# EAGLE schematic UV_Curing-PCB (EAGLE 9.6.2)
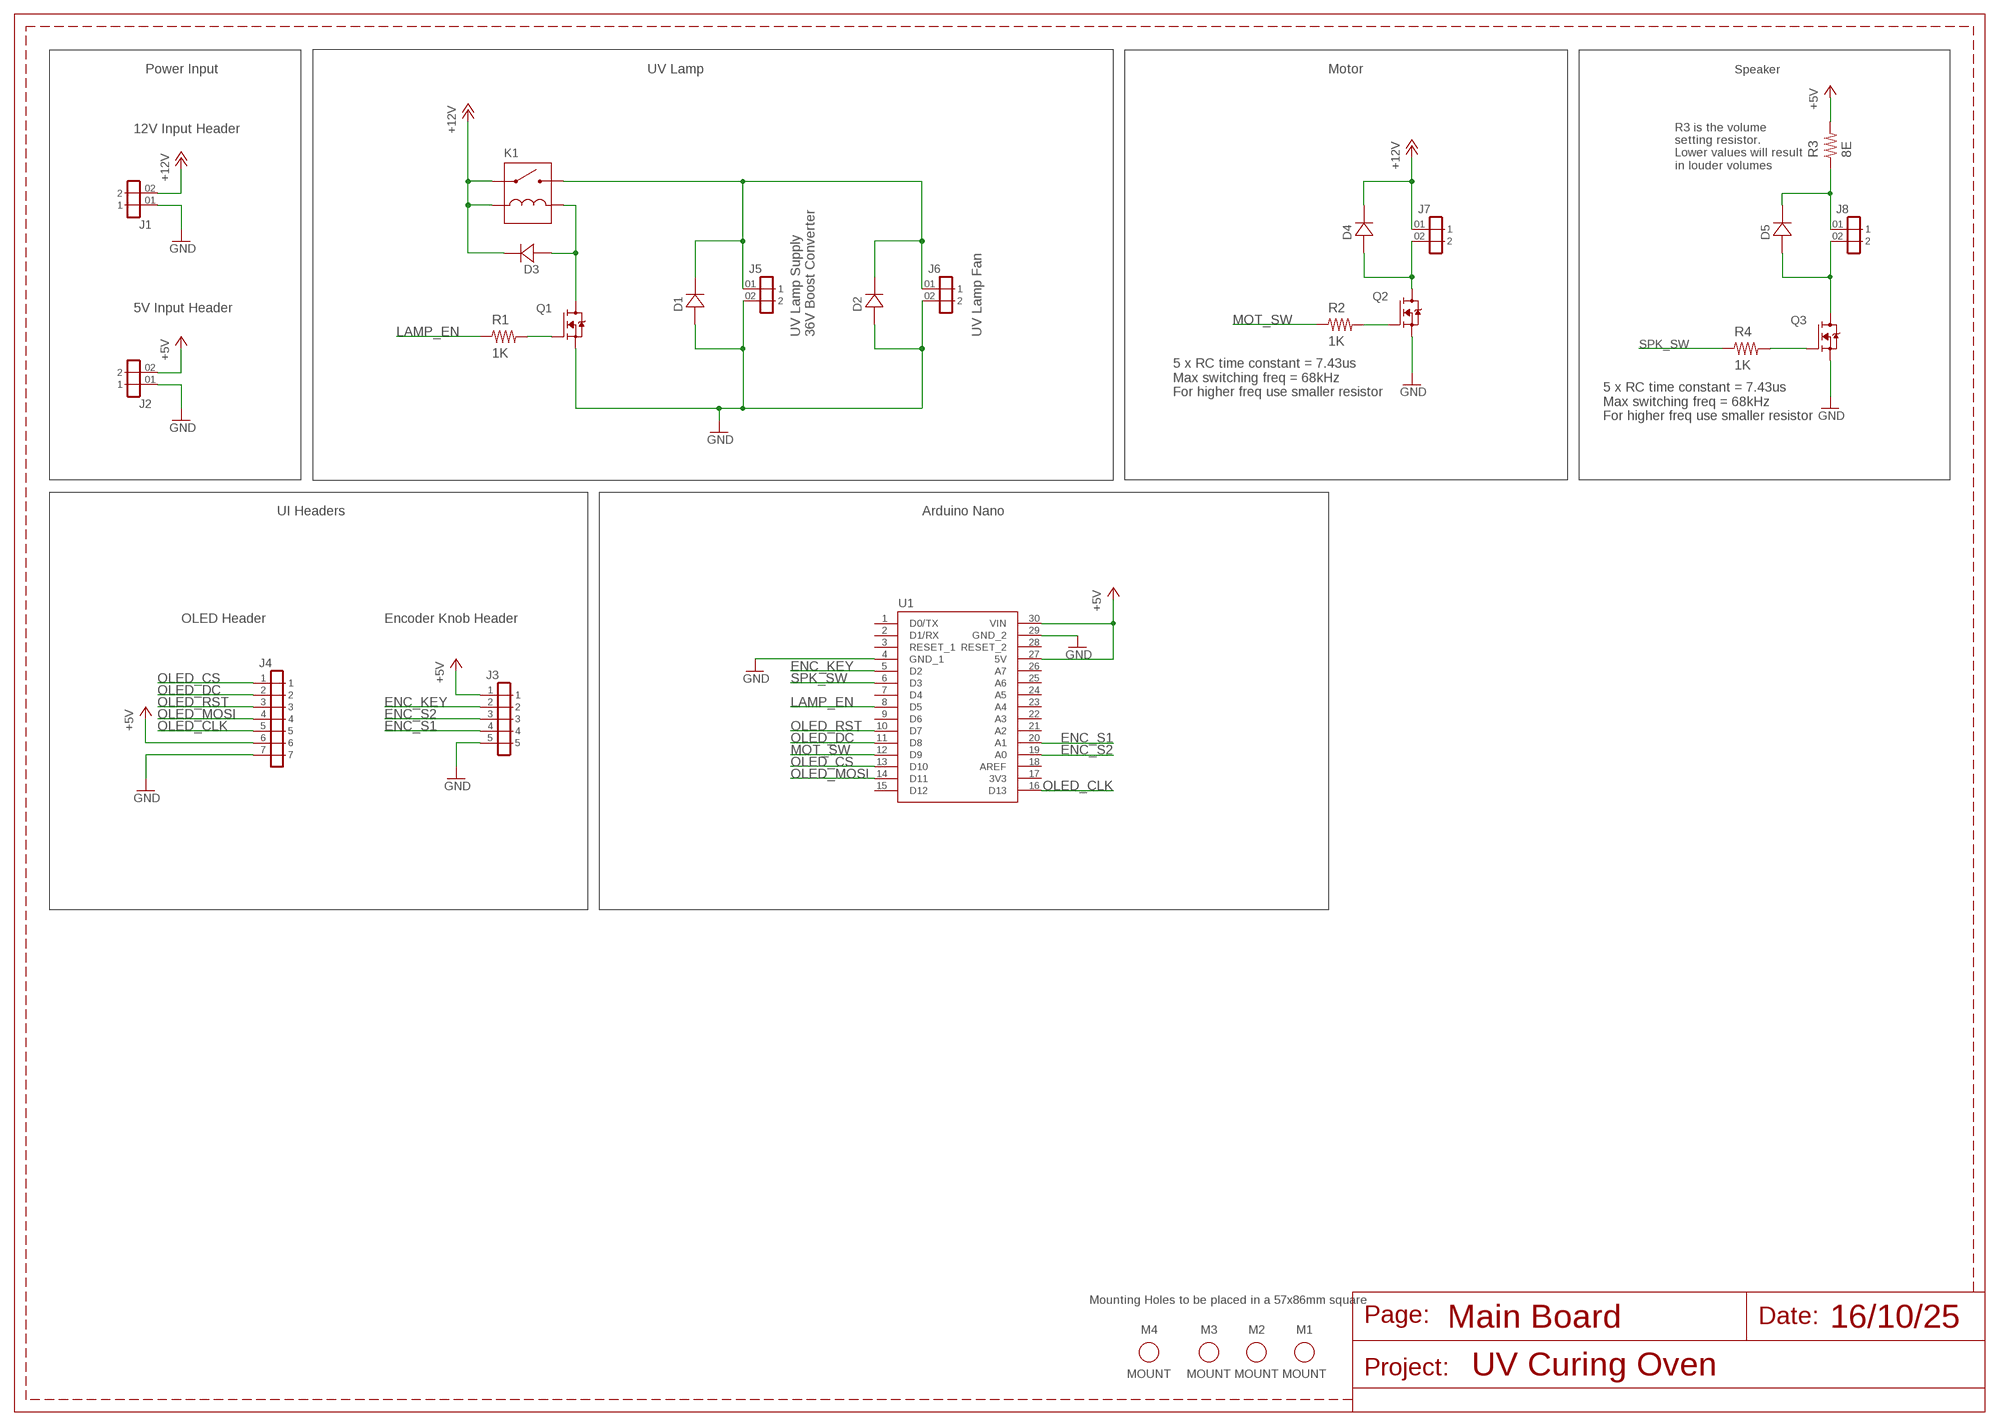
[diagram p0: schematic, sheet 1]
PF1 (A3_FRAME): DATE: 16/10/25; PAGE: Main Board; PROJECT: UV Curing Oven

## Parts
D1  400V  DIODE-DO-41-TH  [DIOAD520W79L463D238]
D2  400V  DIODE-DO-41-TH  [DIOAD520W79L463D238]
D3  400V  DIODE-DO-41-TH  [DIOAD520W79L463D238]
D4  400V  DIODE-DO-41-TH  [DIOAD520W79L463D238]
D5  400V  DIODE-DO-41-TH  [DIOAD520W79L463D238]
J1  PINHEADER-2POS-2.54MM  [254-1X02-PIN]
J2  PINHEADER-2POS-2.54MM  [254-1X02-PIN]
J3  PINHEADER-5POS-2.54MM  [254-1X05-PIN]
J4  PINHEADER-7POS-2.54MM  [254-1X07-PIN]
J5  PINHEADER-2POS-2.54MM  [254-1X02-PIN]
J6  PINHEADER-2POS-2.54MM  [254-1X02-PIN]
J7  PINHEADER-2POS-2.54MM  [254-1X02-PIN]
J8  PINHEADER-2POS-2.54MM  [254-1X02-PIN]
K1  25V  RELAY-NO  [JY25HK505]
M1  MOUNTING_HOLE  [M4_NP_MOUNTING_HOLE]
M2  MOUNTING_HOLE  [M4_NP_MOUNTING_HOLE]
M3  MOUNTING_HOLE  [M4_NP_MOUNTING_HOLE]
M4  MOUNTING_HOLE  [M4_NP_MOUNTING_HOLE]
Q1  55V  MOSFET-NCH-TO-220AB-TH  [TO254P1016X419X2286-3]
Q2  55V  MOSFET-NCH-TO-220AB-TH  [TO254P1016X419X2286-3]
Q3  55V  MOSFET-NCH-TO-220AB-TH  [TO254P1016X419X2286-3]
R1  1K  MFR-25FBF52-1K  [RES-THRU]
R2  1K  MFR-25FBF52-1K  [RES-THRU]
R3  8E  MFR-25FBF52-1K  [RES-THRU]
R4  1K  MFR-25FBF52-1K  [RES-THRU]
U1  A000005  [MODULE_A000005]

## Nets
+5V: J2.02 J3.1 J4.6 R3.2 U1.27(5V) U1.30(VIN)
+12V: D3.C D4.C J1.02 J7.01 K1.8(COIL_1) K1.16(COM)
ENC_KEY: J3.2 U1.5(D2)
ENC_S1: J3.4 U1.20(A1)
ENC_S2: J3.3 U1.19(A0)
GND: D1.A D2.A J1.01 J2.01 J3.5 J4.7 J5.02 J6.02 Q1.3(S) Q2.3(S) Q3.3(S) U1.4(GND_1) U1.29(GND_2)
LAMP_EN: R1.1 U1.8(D5)
MOT_SW: R2.1 U1.12(D9)
N$1: Q1.1(G) R1.2
N$2: D1.C D2.C J5.01 J6.01 K1.13(NO)
N$3: D3.A K1.9(COIL_2) Q1.2(D)
N$4: Q2.1(G) R2.2
N$5: D4.A J7.02 Q2.2(D)
N$6: D5.C J8.01 R3.1
N$7: D5.A J8.02 Q3.2(D)
N$9: Q3.1(G) R4.2
OLED_CLK: J4.5 U1.16(D13)
OLED_CS: J4.1 U1.13(D10)
OLED_DC: J4.2 U1.11(D8)
OLED_MOSI: J4.4 U1.14(D11)
OLED_RST: J4.3 U1.10(D7)
SPK_SW: R4.1 U1.6(D3)
Unconnected: U1.1(D0/TX) U1.2(D1/RX) U1.3(RESET_1) U1.7(D4) U1.9(D6) U1.15(D12) U1.18(AREF) U1.21(A2) U1.22(A3) U1.23(A4) U1.24(A5) U1.25(A6) U1.26(A7) U1.28(RESET_2)

## Notes on the sheet
- Power Input | UV Lamp | Motor | Speaker
- 12V Input Header
- R3 is the volume 
  setting resistor.
  Lower values will result
  in louder volumes
- 5V Input Header
- UV Lamp Supply
  36V Boost Converter
- UV Lamp Fan
- 5 x RC time constant = 7.43us
  Max switching freq = 68kHz
  For higher freq use smaller resistor
- 5 x RC time constant = 7.43us
  Max switching freq = 68kHz
  For higher freq use smaller resistor
- UI Headers | Arduino Nano
- OLED Header | Encoder Knob Header
- Mounting Holes to be placed in a 57x86mm square

## Power pins joined to a net without a drawn wire
3V3: U1.17(3V3)

## Library data of the parts
D1-D5 = Up3D Active Components:DIODE; DESCRIPTION: Diode, DO-41, 400V, 1A, 175C; DIGIKEY: 1N4004-TPMSCT-ND; MF: Diotec Semiconductor; MP: 1N4004
J1 J2 J5-J8 = Up3D Misc:PINHEADER-2POS; DESCRIPTION: Connector Header Through Hole 2 position 0.100 (2.54mm); DIGIKEY: 732-5315-ND; MF: Wurth Electronics; MP: 61300211121
J3 = Up3D Misc:PINHEADER-5POS; DESCRIPTION: Connector Header Through Hole 5 position 0.100 (2.54mm); DIGIKEY: 732-5318-ND; MF: Wurth Electronics; MP: 61300511121
J4 = Up3D Misc:PINHEADER-7POS; DESCRIPTION: Connector Header Through Hole 7 position 0.100 (2.54mm); DIGIKEY: 732-5320-ND; MF: Wurth Elektronik; MP: 61300711121
K1 = Up3D Active Components:RELAY-NO; DESCRIPTION: General Purpose Relays 5A N.O. PCB; MF: FUJITSU; MP: JY-25H-K-505
M1-M4 = Up3D Misc:MOUNTING_HOLE; DRILL: M4
Q1-Q3 = Up3D Active Components:MOSFET-NCH; DESCRIPTION: MOSFET, Power,N-Ch,VDSS 55V,RDS(ON) 17.5 Milliohms,ID 49A,TO-220AB,PD 94W,-55C | Infineon IRFZ44NPBF; DIGIKEY: IRFZ44NPBF-ND; MF: Infineon; MP: IRFZ44NPBF
R1 R2 R4 = Up3D Resistors:MFR-25FBF52-1K; DESCRIPTION: 1.07 kOhms ±1% 0.25W, 1/4W Through Hole Resistor Axial - Metal Film; DIGIKEY: CFR200J1K0; MF: Yageo; MP: MFR-25FBF52-1K
R3 = Up3D Resistors:MFR-25FBF52-1K; DESCRIPTION: 1.07 kOhms ±1% 0.25W, 1/4W Through Hole Resistor Axial - Metal Film; DIGIKEY: CFR200J1K0; MF: Yageo; MP: MFR-25FBF52-1K; VALUE: 1K
U1 = Up3D ICs:A000005: CLOCK SAW OSCILLATOR SEAM7050 T& Check availability <https://pricing.snapeda.com/parts/A000005/Arduino/view-part?ref=eda>; DESCRIPTION: Arduino Nano Microcontroller Board, ATmega328 | Arduino A000005; MF: Arduino; MP: A000005